# Altium project dashcam_cpu_v2.0.PrjPcb (part 9 of 13)

## Sheet usb_debug.SchDoc
size A3; SheetNumber: 11; SheetTotal: 15
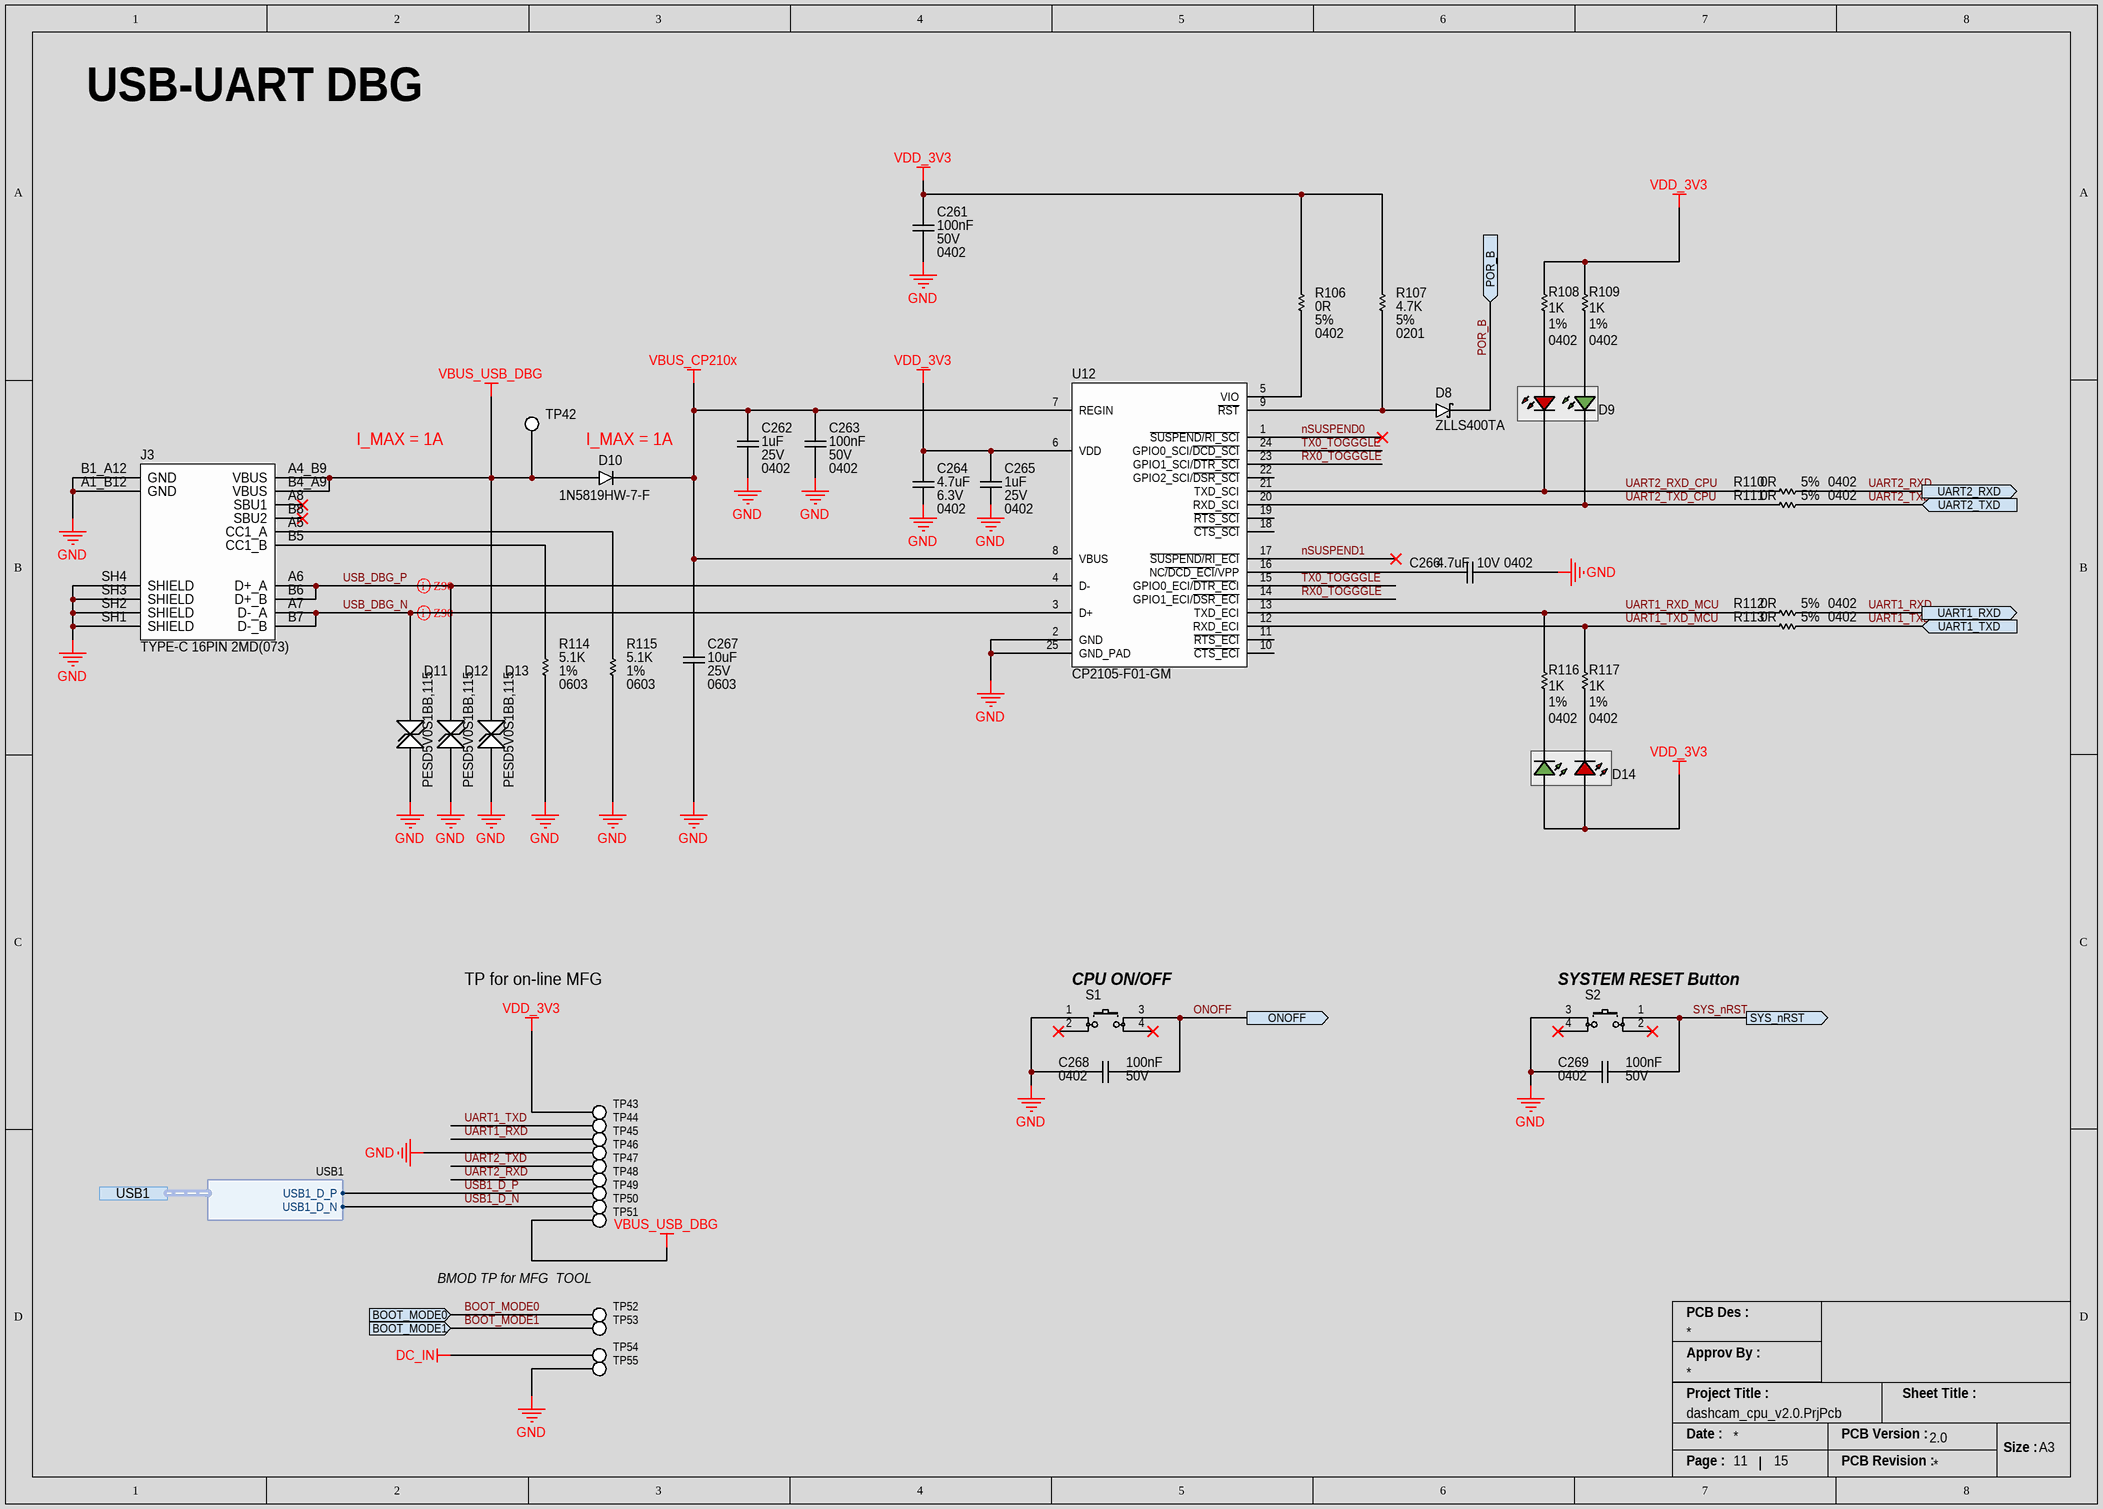
[diagram p11: usb_debug.SchDoc]

### Parts
C261  Voltage Rating: 50V  Capacitance: 100nF  Case/Package: 0402  [CAP_0402_CAPC1005X05N]  (hidden comment: GRM155R71H104KE14D)
C262  Voltage Rating: 25V  Capacitance: 1uF  Case Code (Imperial): 0402  [CAP_0402_CAPC1005X05N]  (hidden comment: GRM155R61E105KA12D)
C263  Voltage Rating: 50V  Capacitance: 100nF  Case/Package: 0402  [CAP_0402_CAPC1005X05N]  (hidden comment: GRM155R71H104KE14D)
C264  Capacitance: 4.7uF  Voltage Rating: 6.3V  Case/Package: 0402  [CAP_0402_CAPC1005X05N]  (hidden comment: C1005X5R0J475M050BC)
C265  Voltage Rating: 25V  Capacitance: 1uF  Case Code (Imperial): 0402  [CAP_0402_CAPC1005X05N]  (hidden comment: GRM155R61E105KA12D)
C266  Capacitance: 4.7uF  Voltage Rating: 10V  Case/Package: 0402  [CAP_0402_CAPC1005X05N]  (hidden comment: CL05A475KP5NRNC)
C267  Case/Package: 0603  Capacitance: 10uF  Voltage Rating: 25V  [CAP_0603_CAPC1608X08N]  (hidden comment: GRM188R61E106MA73D)
C268  Voltage Rating: 50V  Capacitance: 100nF  Case/Package: 0402  [CAP_0402_CAPC1005X05N]  (hidden comment: GRM155R71H104KE14D)
C269  Voltage Rating: 50V  Capacitance: 100nF  Case/Package: 0402  [CAP_0402_CAPC1005X05N]  (hidden comment: GRM155R71H104KE14D)
D8  ZLLS400TA  [DIO_SOD2512X113N]
D9  LTST-C195KGJRKT  [DIO_LED0606_LTST-C195]  (value not drawn)
D10  1N5819HW-7-F  [DIO_SOD3716X145N]
D11  PESD5V0S1BB,115  [DIO_TVS_SODFL1608X65N]
D12  PESD5V0S1BB,115  [DIO_TVS_SODFL1608X65N]
D13  PESD5V0S1BB,115  [DIO_TVS_SODFL1608X65N]
D14  LTST-C195KGJRKT  [DIO_LED0606_LTST-C195]  (value not drawn)
J3  TYPE-C 16PIN 2MD(073)  [CONN_USB_C_16P]
R106  Case Code (Imperial): 0402  Tolerance: 5%  Resistance: 0R  [RES_0402_RESC1005X04N]  (hidden comment: ERJ-2GE0R00X)
R107  Tolerance: 5%  Resistance: 4.7K  Case/Package: 0201  [RES_0201_RESC0603X02N]  (hidden comment: RK73B1HTTC472J)
R108  Resistance: 1K  Tolerance: 1%  Case/Package: 0402  [RES_0402_RESC1005X04N]  (hidden comment: ERJ-2RKF1001X)
R109  Resistance: 1K  Tolerance: 1%  Case/Package: 0402  [RES_0402_RESC1005X04N]  (hidden comment: ERJ-2RKF1001X)
R110  Case Code (Imperial): 0402  Tolerance: 5%  Resistance: 0R  [RES_0402_RESC1005X04N]  (hidden comment: ERJ-2GE0R00X)
R111  Case Code (Imperial): 0402  Tolerance: 5%  Resistance: 0R  [RES_0402_RESC1005X04N]  (hidden comment: ERJ-2GE0R00X)
R112  Case Code (Imperial): 0402  Tolerance: 5%  Resistance: 0R  [RES_0402_RESC1005X04N]  (hidden comment: ERJ-2GE0R00X)
R113  Case Code (Imperial): 0402  Tolerance: 5%  Resistance: 0R  [RES_0402_RESC1005X04N]  (hidden comment: ERJ-2GE0R00X)
R114  Tolerance: 1%  Resistance: 5.1K  Case/Package: 0603  [RES_0603_RESC1608X04N]  (hidden comment: RC0603FR-075K1L)
R115  Tolerance: 1%  Resistance: 5.1K  Case/Package: 0603  [RES_0603_RESC1608X04N]  (hidden comment: RC0603FR-075K1L)
R116  Resistance: 1K  Tolerance: 1%  Case/Package: 0402  [RES_0402_RESC1005X04N]  (hidden comment: ERJ-2RKF1001X)
R117  Resistance: 1K  Tolerance: 1%  Case/Package: 0402  [RES_0402_RESC1005X04N]  (hidden comment: ERJ-2RKF1001X)
S1  PTS526SK15SMTR2LFS  [SWT_NO_PTS526SK15SMTR2LFS]  (value not drawn)
S2  PTS526SK15SMTR2LFS  [SWT_NO_PTS526SK15SMTR2LFS]  (value not drawn)
TP42  NO COMPONENT  [TP_PAD_1.6MM_SMD_ROUND]  (value not drawn)  (no BOM)
TP43  NO COMPONENT  [TP_PAD_1.6MM_SMD_ROUND]  (value not drawn)  (no BOM)
TP44  NO COMPONENT  [TP_PAD_1.6MM_SMD_ROUND]  (value not drawn)  (no BOM)
TP45  NO COMPONENT  [TP_PAD_1.6MM_SMD_ROUND]  (value not drawn)  (no BOM)
TP46  NO COMPONENT  [TP_PAD_1.6MM_SMD_ROUND]  (value not drawn)  (no BOM)
TP47  NO COMPONENT  [TP_PAD_1.6MM_SMD_ROUND]  (value not drawn)  (no BOM)
TP48  NO COMPONENT  [TP_PAD_1.6MM_SMD_ROUND]  (value not drawn)  (no BOM)
TP49  NO COMPONENT  [TP_PAD_1.6MM_SMD_ROUND]  (value not drawn)  (no BOM)
TP50  NO COMPONENT  [TP_PAD_1.6MM_SMD_ROUND]  (value not drawn)  (no BOM)
TP51  NO COMPONENT  [TP_PAD_1.6MM_SMD_ROUND]  (value not drawn)  (no BOM)
TP52  NO COMPONENT  [TP_PAD_1.6MM_SMD_ROUND]  (value not drawn)  (no BOM)
TP53  NO COMPONENT  [TP_PAD_1.6MM_SMD_ROUND]  (value not drawn)  (no BOM)
TP54  NO COMPONENT  [TP_PAD_1.6MM_SMD_ROUND]  (value not drawn)  (no BOM)
TP55  NO COMPONENT  [TP_PAD_1.6MM_SMD_ROUND]  (value not drawn)  (no BOM)
U12  CP2105-F01-GM  [IC_USB_UART_QFN50P400X400X80-25N-D]

### Ports
BOOT_MODE0 (in), BOOT_MODE1 (in), ONOFF (out), POR_B (in), SYS_nRST (out), UART1_RXD (out), UART1_TXD (in), UART2_RXD (out), UART2_TXD (in), USB1 (harness USB1)

### Harnesses
USB1: USB1_D_N, USB1_D_P

### Nets
DC_IN: TP54.1
GND: C261.1 C262.1 C263.1 C264.1 C265.1 C266.2 C267.1 C268.2 C269.2 D11.1(K1) D12.1(K1) D13.1(K1) J3.A1_B12(GND) J3.B1_A12(GND) J3.SH1(SHIELD) J3.SH2(SHIELD) J3.SH3(SHIELD) J3.SH4(SHIELD) R114.1 R115.1 S1.1(COM_1) S2.3(NO1) TP46.1 TP55.1 U12.2(GND) U12.25(GND_PAD)
VBUS_CP210x: C262.2 C263.2 C267.2 D10.1(K) U12.7(REGIN) U12.8(VBUS)
VBUS_USB_DBG: D10.2(A) D13.2(K2) J3.A4_B9(VBUS) J3.B4_A9(VBUS) TP42.1 TP51.1
VDD_3V3: C261.2 C264.2 C265.2 D14.1(A1) D14.2(A2) R106.2 R107.2 R108.2 R109.2 TP43.1 U12.6(VDD)
BOOT_MODE0: TP52.1 ; port BOOT_MODE0
BOOT_MODE1: TP53.1 ; port BOOT_MODE1
nSUSPEND0: U12.1(~{SUSPEND/RI_SCI})
nSUSPEND1: U12.17(~{SUSPEND/RI_ECI})
ONOFF: C268.1 S1.3(NO1) ; port ONOFF
POR_B: D8.1(K) ; port POR_B
RX0_TOGGGLE: U12.14(GPIO1_ECI/~{DSR_ECI}) U12.23(GPIO1_SCI/~{DTR_SCI})
SYS_nRST: C269.1 S2.1(COM_1) ; port SYS_nRST
TX0_TOGGGLE: U12.15(GPIO0_ECI/~{DTR_EC}I) U12.24(GPIO0_SCI/~{DCD_SCI})
UART1_RXD: R112.2 TP45.1 ; port UART1_RXD
UART1_RXD_MCU: R112.1 R116.2 U12.13(TXD_ECI)
UART1_TXD: R113.2 TP44.1 ; port UART1_TXD
UART1_TXD_MCU: R113.1 R117.2 U12.12(RXD_ECI)
UART2_RXD: R110.2 TP48.1 ; port UART2_RXD
UART2_RXD_CPU: D9.4(K1) R110.1 U12.21(TXD_SCI)
UART2_TXD: R111.2 TP47.1 ; port UART2_TXD
UART2_TXD_CPU: D9.3(K1) R111.1 U12.20(RXD_SCI)
USB1_D_N: TP50.1 ; port USB1.USB1_D_N
USB1_D_P: TP49.1 ; port USB1.USB1_D_P
USB_DBG_N: D11.2(K2) J3.A7(D-_A) J3.B7(D-_B) U12.3(D+)
USB_DBG_P: D12.2(K2) J3.A6(D+_A) J3.B6(D+_B) U12.4(D-)
NetC266_1: C266.1 U12.16(NC~{/DCD_ECI}/VPP)
NetD8_2: D8.2(A) R107.1 U12.9(~{RST})
NetD9_1: D9.1(A1) R109.1
NetD9_2: D9.2(A2) R108.1
NetD14_3: D14.3(K1) R116.1
NetD14_4: D14.4(K1) R117.1
NetJ3_A5: J3.A5(CC1_A) R115.2
NetJ3_B5: J3.B5(CC1_B) R114.2
NetR106_1: R106.1 U12.5(VIO)

Not connected (* = marked no-connect by the designer): J3 A8(SBU1)* B8(SBU2)*; S1 2(COM2)* 4(NO2)*; S2 2(COM2)* 4(NO2)*; U12 10(~{CTS_ECI}) 11(~{RTS_ECI}) 18(~{CTS_SCI}) 19(~{RTS_SCI}) 22(GPIO2_SCI/~{DSR_SCI})

### Layout directives
differential pair; differential pair class Z90; net class Z90: USB_DBG_N, USB_DBG_P

### Notes on the sheet
- USB-UART DBG
- I_MAX = 1A
- (near D10) I_MAX = 1A
- TP for on-line MFG
- (near S1) CPU ON/OFF
- (near S2) SYSTEM RESET Button
- BMOD TP for MFG  TOOL
- PCB Des :
- Approv By :
- Project Title :
- Sheet Title :
- Date :
- PCB Version :
- Size :
- A3
- Page :
- PCB Revision :

### Library data of the parts
C261 C263 C268 C269 = CAP_100NF_50V_X7R_0402: Multilayer Ceramic Capacitor, 0.1 uF, 16 V, ± 10%, X7R, 0402 [1005 Metric]; Manufacturer: Murata; Dissipation Factor: 0.025%; Temperature Coefficient: 30ppm/°C; Supplier 1: DigiKey; Manufacturer Part Number: GRM155R71H104KE14D; RoHS: Yes; Category: Ceramic Capacitors; Stock 1: 13730790; Pricing 1: 1=0.1, 10=0.023, 50=0.0132, 100=0.0102, 500=0.00768, 1000=0.00603, 2500=0.00548, 5000=0.00504 (USD); Mount: Surface Mount; Number of Pins: 2NUMBER; Case Code (Metric): 1005; Material: Ceramic; Case Code (Imperial): 0402; Weight: 0.000212oz; Dielectric Material: Ceramic; Min Operating Temperature: -55°C; Max Operating Temperature: 125°C; Packaging: Tape and Reel; Package Quantity: 10000; Series: GRM; Tolerance: 10%; Dielectric: X7R; Termination: SMD/SMT; Voltage: 50V; Voltage Rating (DC): 50V; Construction: Flat; Length: 1mm; Width: 0.5mm; Height: 0.5mm; Depth: 0.5mm; Thickness: 0.022inch; Reach SVHC Compliant: No; RoHS Compliant: Yes; Lead Free: 5697LeadFree; ComponentLink1URL: http://www.farnell.com/datasheets/2079156.pdf?src-supplier=Farnell; ComponentLink1Description: http://www.farnell.com/datasheets/2079156.pdf?src-supplier=Farnell; ComponentLink2URL: http://www.mouser.com/ds/2/281/c02e-2905.pdf?src-supplier=Mouser; ComponentLink2Description: http://www.mouser.com/ds/2/281/c02e-2905.pdf?src-supplier=Mouser; ComponentLink3URL: http://www.farnell.com/datasheets/2079156.pdf?src-supplier=Newark; ComponentLink3Description: http://www.farnell.com/datasheets/2079156.pdf?src-supplier=Newark; ComponentLink4URL: https://datasheet.octopart.com/GRM155R71H104KE14D-Murata-datasheet-22122223.pdf?src-supplier=Future+Electronics; ComponentLink4Description: https://datasheet.octopart.com/GRM155R71H104KE14D-Murata-datasheet-22122223.pdf?src-supplier=Future+Electronics; ComponentLink5URL: https://search.murata.co.jp/Ceramy/image/img/A01X/G101/ENG/GRM155R71H104KE14-01.pdf?src-supplier=Digi-Key; ComponentLink5Description: https://search.murata.co.jp/Ceramy/image/img/A01X/G101/ENG/GRM155R71H104KE14-01.pdf?src-supplier=Digi-Key; ComponentLink6URL: http://psearch.en.murata.com/capacitor/product/GRM155R71H104KE14%23.pdf?src-supplier=Avnet; ComponentLink6Description: http://psearch.en.murata.com/capacitor/product/GRM155R71H104KE14%23.pdf?src-supplier=Avnet; ComponentLink7URL: https://datasheet.octopart.com/GRM155R71H104KE14D-Murata-datasheet-66077078.pdf?src-supplier=Element14; ComponentLink7Description: https://datasheet.octopart.com/GRM155R71H104KE14D-Murata-datasheet-66077078.pdf?src-supplier=Element14; Supplier Part Number 1: 490-10700-6-ND; Supplier 2: Digikey; Stock 2: 3706055; Pricing 2: 1=0.1, 10=0.037, 50=0.021, 100=0.0162, 500=0.01224, 1000=0.00961, 2500=0.00874, 5000=0.00804 (USD); Halogen Free: 5694HalogenFree; ComponentLink8URL: http://www.mouser.com/ds/2/447/UPY-GPHC_X5R_4V-to-50V_25-1131599.pdf?src-supplier=Mouser; ComponentLink8Description: http://www.mouser.com/ds/2/447/UPY-GPHC_X5R_4V-to-50V_25-1131599.pdf?src-supplier=Mouser; ComponentLink9URL: https://datasheet.octopart.com/CC0402KRX5R8BB104-Yageo-datasheet-137700082.pdf?src-supplier=Future+Electronics; ComponentLink9Description: https://datasheet.octopart.com/CC0402KRX5R8BB104-Yageo-datasheet-137700082.pdf?src-supplier=Future+Electronics; ComponentLink10URL: http://www.yageo.com/documents/recent/UPY-GPHC_X5R_4V-to-50V_25.pdf?src-supplier=Digikey; ComponentLink10Description: http://www.yageo.com/documents/recent/UPY-GPHC_X5R_4V-to-50V_25.pdf?src-supplier=Digikey; ComponentLink11URL: https://datasheet.octopart.com/CC0402KRX5R8BB104-Yageo-datasheet-140260304.pdf?src-supplier=Newark; ComponentLink11Description: https://datasheet.octopart.com/CC0402KRX5R8BB104-Yageo-datasheet-140260304.pdf?src-supplier=Newark; ComponentLink12URL: https://datasheet.octopart.com/CC0402KRX5R8BB104-Yageo-datasheet-170350636.pdf?src-supplier=Future+Electronics; ComponentLink12Description: https://datasheet.octopart.com/CC0402KRX5R8BB104-Yageo-datasheet-170350636.pdf?src-supplier=Future+Electronics; ComponentLink13URL: http://www.yageo.com/documents/recent/UPY-GPHC_X5R_4V-to-50V-16.pdf?src-supplier=Future+Electronics; ComponentLink13Description: http://www.yageo.com/documents/recent/UPY-GPHC_X5R_4V-to-50V-16.pdf?src-supplier=Future+Electronics; Supplier Part Number 2: 311-1697-1-ND
C262 C265 = CAP_1UF_25V_X5R_0402: Multilayer Ceramic Capacitor, 1 uF, 25 V, ± 10%, X5R, 0402 [1005 Metric]; Manufacturer: Murata; Supplier 1: Digi-Key; Manufacturer Part Number: GRM155R61E105KA12D; RoHS: Yes; Category: Ceramic Capacitors; Stock 1: 849086; Pricing 1: 1=0.1, 10=0.043, 50=0.0246, 100=0.019, 500=0.01434, 1000=0.01126, 2500=0.01024, 5000=0.00942 (USD); Mount: Surface Mount; Case/Package: 0402; Case Code (Metric): 1005; Material: Ceramic; Weight: 0.000212oz; Min Operating Temperature: -55°C; Max Operating Temperature: 85°C; Tolerance: 10%; Packaging: Cut Tape; Dielectric: X5R; Voltage: 25V; Termination: SMD/SMT; Voltage Rating (DC): 25V; Package Quantity: 10000; Series: GRM; Length: 1mm; Width: 0.5mm; Height: 0.5mm; Thickness: 0.022inch; Depth: 0.5mm; Reach SVHC Compliant: No; Lead Free: Lead Free; RoHS Compliant: Yes; ComponentLink1URL: https://datasheet.ciiva.com/7719/1666664-7719006.pdf?src-supplier=Element14; ComponentLink1Description: https://datasheet.ciiva.com/7719/1666664-7719006.pdf?src-supplier=Element14; ComponentLink2URL: https://datasheet.ciiva.com/22732/1666664-22732122.pdf?src-supplier=Element14; ComponentLink2Description: https://datasheet.ciiva.com/22732/1666664-22732122.pdf?src-supplier=Element14; Supplier Part Number 1: 490-10017-1-ND
C264 = CAP_4.7UF_6.3V_X5R_0402: Multilayer Ceramic Capacitor, 4.7 uF, 6.3 V, ± 20%, X5R, 0402 [1005 Metric]; Manufacturer: TDK; Material: 4241ConductorMaterial; Dissipation Factor: 10%; Supplier 1: Digi-Key; Manufacturer Part Number: C1005X5R0J475M050BC; RoHS: Yes; Category: Ceramic Capacitors; Stock 1: 799722; Pricing 1: 1=0.35, 10=0.233, 50=0.1716, 100=0.1396, 500=0.11024, 1000=0.0931, 2500=0.0882, 5000=0.0833 (USD); Mount: Surface Mount; Dielectric Material: Ceramic; Case Code (Metric): 1005; Case Code (Imperial): 0402; Weight: 2.3E-05oz; Min Operating Temperature: -55°C; Max Operating Temperature: 85°C; Packaging: Tape and Reel; Tolerance: 20%; Voltage Rating (DC): 6.3V; Dielectric: X5R; Package Quantity: 1; Termination: SMD/SMT; Voltage: 6.3V; Series: C; Construction: Flat; Length: 1mm; Width: 0.02inch; Height: 0.5mm; Depth: 0.5mm; Thickness: 0.026inch; Lead Free: Lead Free; Reach SVHC Compliant: No; RoHS Compliant: Yes; ComponentLink1URL: https://datasheet.ciiva.com/24216/c1005x5r0j475m050bc-264348-24216583.pdf?src-supplier=Mouser; ComponentLink1Description: https://datasheet.ciiva.com/24216/c1005x5r0j475m050bc-264348-24216583.pdf?src-supplier=Mouser; ComponentLink2URL: https://datasheet.ciiva.com/5962/639999-5962567.pdf?src-supplier=Farnell; ComponentLink2Description: https://datasheet.ciiva.com/5962/639999-5962567.pdf?src-supplier=Farnell; ComponentLink3URL: https://datasheet.ciiva.com/22648/1796654-22648701.pdf?src-supplier=Element14; ComponentLink3Description: https://datasheet.ciiva.com/22648/1796654-22648701.pdf?src-supplier=Element14; ComponentLink4URL: https://datasheet.ciiva.com/22749/1744655-22749711.pdf?src-supplier=Element14; ComponentLink4Description: https://datasheet.ciiva.com/22749/1744655-22749711.pdf?src-supplier=Element14; ComponentLink5URL: https://datasheet.ciiva.com/7770/639999-7770124.pdf?src-supplier=Element14; ComponentLink5Description: https://datasheet.ciiva.com/7770/639999-7770124.pdf?src-supplier=Element14; ComponentLink6URL: https://datasheet.ciiva.com/6289/tdkmlcccaprange-6289886.pdf?src-supplier=Digi-Key; ComponentLink6Description: https://datasheet.ciiva.com/6289/tdkmlcccaprange-6289886.pdf?src-supplier=Digi-Key; ComponentLink7URL: https://datasheet.ciiva.com/6289/tdkmlcccaprange-6289895.pdf?src-supplier=Digi-Key; ComponentLink7Description: https://datasheet.ciiva.com/6289/tdkmlcccaprange-6289895.pdf?src-supplier=Digi-Key; ComponentLink8URL: https://datasheet.ciiva.com/16425/e412-c-16425670.pdf?src-supplier=Future+Electronics; ComponentLink8Description: https://datasheet.ciiva.com/16425/e412-c-16425670.pdf?src-supplier=Future+Electronics; Supplier Part Number 1: 445-7395-1-ND
C266 = CAP_4.7UF_10V_X5R_0402: as C252 on sheet emmc_flash; Supplier 1: Digikey; Manufacturer Part Number: CL05A475KP5NRNC; RoHS: Yes; Category: Ceramic Capacitors; Stock 1: 748042; Pricing 1: 1=0.28, 10=0.184, 50=0.129, 100=0.1042, 500=0.0774, 1000=0.06772, 2500=0.0645, 5000=0.05966 (USD); Mount: Surface Mount; Case Code (Metric): 1005; Case Code (Imperial): 0402; Material: Ceramic; Min Operating Temperature: -55°C; Max Operating Temperature: 85°C; Tolerance: 10%; Packaging: Tape and Reel; Package Quantity: 1; Dielectric: X5R; Series: CL; Construction: Flat; Length: 1mm; Width: 0.02inch; Height: 0.5mm; Thickness: 0.022inch; Depth: 0.5mm; Radiation Hardening: No; RoHS Compliant: Yes; Lead Free: Lead Free; ComponentLink1URL: https://datasheet.ciiva.com/25724/cl05a475kp5nrnc-25724404.pdf?src-supplier=Digikey; ComponentLink1Description: https://datasheet.ciiva.com/25724/cl05a475kp5nrnc-25724404.pdf?src-supplier=Digikey; ComponentLink2URL: https://datasheet.ciiva.com/29198/458873-da-01-en-vs-kondensator-0402-29198304.pdf?src-supplier=Conrad; ComponentLink2Description: https://datasheet.ciiva.com/29198/458873-da-01-en-vs-kondensator-0402-29198304.pdf?src-supplier=Conrad; Supplier Part Number 1: 1276-1480-1-ND
C267 = CAP_10UF_25V_X5R_0603: Multilayer Ceramic Capacitor, 10 uF, 25 V, ± 20%, X5R, 0603 [1608 Metric]; Manufacturer: Murata; Material: 4241ConductorMaterial; Supplier 1: Digi-Key; Manufacturer Part Number: GRM188R61E106MA73D; RoHS: Yes; Category: Ceramic Capacitors; Stock 1: 2712970; Pricing 1: 1=0.26, 10=0.168, 50=0.1176, 100=0.0949, 500=0.07054, 1000=0.06173 (USD); Mount: Surface Mount; Number of Pins: 2; Case Code (Imperial): 0603; Weight: 0.000222oz; Min Operating Temperature: -55°C; Max Operating Temperature: 85°C; Tolerance: 20%; Packaging: Cut Tape; Package Quantity: 1; Dielectric: X5R; Voltage: 25V; Termination: SMD/SMT; Voltage Rating (DC): 25V; Series: GRM; Construction: Flat; Length: 1.6mm; Width: 0.031inch; Height: 0.8mm; Thickness: 0.031inch; Depth: 0.8mm; Reach SVHC Compliant: No; Lead Free: Lead Free; RoHS Compliant: Yes; ComponentLink1URL: https://datasheet.ciiva.com/22776/c02e-22776427.pdf?src-supplier=Farnell; ComponentLink1Description: https://datasheet.ciiva.com/22776/c02e-22776427.pdf?src-supplier=Farnell; ComponentLink2URL: https://datasheet.ciiva.com/22619/c02e-22619674.pdf?src-supplier=Element14; ComponentLink2Description: https://datasheet.ciiva.com/22619/c02e-22619674.pdf?src-supplier=Element14; ComponentLink3URL: https://datasheet.ciiva.com/22776/608985-22776426.pdf?src-supplier=Farnell; ComponentLink3Description: https://datasheet.ciiva.com/22776/608985-22776426.pdf?src-supplier=Farnell; ComponentLink4URL: https://datasheet.ciiva.com/14906/partnumbering-e-01-14906431.pdf?src-supplier=Digi-Key; ComponentLink4Description: https://datasheet.ciiva.com/14906/partnumbering-e-01-14906431.pdf?src-supplier=Digi-Key; ComponentLink5URL: https://datasheet.ciiva.com/14906/partnumbering-e-01-14906429.pdf?src-supplier=Digi-Key; ComponentLink5Description: https://datasheet.ciiva.com/14906/partnumbering-e-01-14906429.pdf?src-supplier=Digi-Key; Supplier Part Number 1: 490-7202-1-ND; Case Code (Metric): 1608
D8 = DIO_SCTKY_40V_520mA_ZLLS400TA: DIODE SCHOTTKY 40V 520MA SOD323; Manufacturer: Diodes Zetex; Peak Non-Repetitive Surge Current: 12A; Max Reverse Current: 10uA; Forward Voltage: 800mV; Reverse Recovery Time: 3ns; Max Forward Surge Current (Ifsm): 2.5A; Power Dissipation: 330mW; Polarity: Standard; Capacitance: 15pF; Supplier 1: Digi-Key; Manufacturer Part Number: ZLLS400TA; RoHS: Yes; Category: Rectifier Diodes; Stock 1: 46017; Pricing 1: 1=0.42, 10=0.359, 100=0.2495, 500=0.19478, 1000=0.15832 (USD); Mount: Surface Mount; Number of Pins: 2; Weight: 0.000173oz; Min Operating Temperature: -55°C; Max Operating Temperature: 150°C; Forward Current: 520mA; Max Repetitive Reverse Voltage (Vrrm): 40V; Package Quantity: 3000; Packaging: Tape and Reel; Average Rectified Current: 520mA; Termination: SMD/SMT; Voltage Rating (DC): 40V; Current Rating: 520mA; Output Current: 520mA; Max Reverse Voltage (DC): 40V; Series: -; Length: 1.8mm; Width: 1.4mm; Height: 0.8mm; Radiation Hardening: No; Lead Free: Lead Free; RoHS Compliant: Yes; ComponentLink1URL: https://datasheet.ciiva.com/914/zlls400-914210.pdf?src-supplier=Digi-Key; ComponentLink1Description: https://datasheet.ciiva.com/914/zlls400-914210.pdf?src-supplier=Digi-Key; ComponentLink2URL: https://datasheet.ciiva.com/914/zlls400-914210.pdf?src-supplier=Avnet; ComponentLink2Description: https://datasheet.ciiva.com/914/zlls400-914210.pdf?src-supplier=Avnet; ComponentLink3URL: https://datasheet.ciiva.com/4715/zlls400-4715517.pdf?src-supplier=Mouser; ComponentLink3Description: https://datasheet.ciiva.com/4715/zlls400-4715517.pdf?src-supplier=Mouser; ComponentLink4URL: https://datasheet.ciiva.com/16379/zlls400-16379288.pdf?src-supplier=Future+Electronics; ComponentLink4Description: https://datasheet.ciiva.com/16379/zlls400-16379288.pdf?src-supplier=Future+Electronics; ComponentLink5URL: https://datasheet.ciiva.com/914/zlls400-914211.pdf?src-supplier=Digi-Key; ComponentLink5Description: https://datasheet.ciiva.com/914/zlls400-914211.pdf?src-supplier=Digi-Key; ComponentLink6URL: https://datasheet.ciiva.com/914/zlls400-914212.pdf?src-supplier=Digi-Key; ComponentLink6Description: https://datasheet.ciiva.com/914/zlls400-914212.pdf?src-supplier=Digi-Key; Supplier Part Number 1: ZLLS400TACT-ND
D9 D14 = LED_DIO_BICOLOR_LTST-C195KGJRKT: LED GREEN/RED CLEAR 0606 SMD; Manufacturer: Vishay Lite-On; Color: Green,Red; Lens Color: Colorless; Lens Style: Flat,Diffused,Colorless,Rectangular,Clear; Viewing Angle: 130°; Luminous Intensity: 45mcd; Forward Current: 30mA; Forward Voltage: 2.4V; Dominant Wavelength: 631nm; Test Current: 20mA; Power Rating: 75mW; Wavelength: 639nm; Number of LEDs: 2; Reverse Voltage: 5V; Lens Size: 1.5mm; Supplier 1: Digikey; Manufacturer Part Number: LTST-C195KGJRKT; RoHS: Yes; Category: LEDs; Stock 1: 405899; Pricing 1: 1=0.43, 10=0.283, 100=0.1886, 500=0.13042, 1000=0.10868, 2000=0.09781 (USD); Mount: Surface Mount; Case/Package: 0606; Number of Pins: 2; Case Code (Metric): 1616; Case Code (Imperial): 0606; Min Operating Temperature: -55°C; Max Operating Temperature: 85°C; Packaging: Tape and Reel; Package Quantity: 4000; Illumination Color: Green,Red; Lens Transparency: Clear; Series: -; Number of Elements: 2; Power Dissipation: 75mW; Length: 1.6mm; Width: 1.5mm; Height: 0.55mm; Depth: 1.5mm; Radiation Hardening: No; RoHS Compliant: Yes; Lead Free: Lead Free; ComponentLink1URL: https://datasheet.ciiva.com/11774/0900766b80dc055f-11774310.pdf?src-supplier=Rs; ComponentLink1Description: https://datasheet.ciiva.com/11774/0900766b80dc055f-11774310.pdf?src-supplier=Rs; ComponentLink2URL: https://datasheet.ciiva.com/16287/ltst-c195kgjrkt-16287821.pdf?src-supplier=Future+Electronics; ComponentLink2Description: https://datasheet.ciiva.com/16287/ltst-c195kgjrkt-16287821.pdf?src-supplier=Future+Electronics; ComponentLink3URL: https://datasheet.ciiva.com/2110/ltst-c195kgjrkt-2110796.pdf?src-supplier=Digikey; ComponentLink3Description: https://datasheet.ciiva.com/2110/ltst-c195kgjrkt-2110796.pdf?src-supplier=Digikey; ComponentLink4URL: https://datasheet.ciiva.com/15117/getdatasheetpartid-123527-15117625.pdf?src-supplier=Verical; ComponentLink4Description: https://datasheet.ciiva.com/15117/getdatasheetpartid-123527-15117625.pdf?src-supplier=Verical; ComponentLink5URL: https://datasheet.ciiva.com/2110/p-100-ltst-c195kgjrkt-2110797.pdf?src-supplier=Digikey; ComponentLink5Description: https://datasheet.ciiva.com/2110/p-100-ltst-c195kgjrkt-2110797.pdf?src-supplier=Digikey; ComponentLink6URL: https://datasheet.ciiva.com/2110/p-100-ltst-c195kgjrkt-2110798.pdf?src-supplier=Digikey; ComponentLink6Description: https://datasheet.ciiva.com/2110/p-100-ltst-c195kgjrkt-2110798.pdf?src-supplier=Digikey; Supplier Part Number 1: 160-1452-1-ND
D10 = DIO_RECT_40V_1A_1N5819HW-7-F: Rectifier Diode, Schottky, 1 Phase, 1 Element, 1A, 40V V(RRM), Silicon; Manufacturer: Diodes; Max Reverse Current: 50uA; Max Forward Surge Current (Ifsm): 25A; Forward Voltage: 450mV; Max Power Dissipation: 450mW; Polarity: Standard; Capacitance: 50pF; Supplier 1: Digikey; Manufacturer Part Number: 1N5819HW-7-F; RoHS: Yes; Category: Rectifier Diodes; Stock 1: 221439; Pricing 1: 1=0.41, 10=0.289, 100=0.146, 500=0.11908, 1000=0.08836 (USD); Case/Package: SOD-123-2; Number of Pins: 2; Weight: 0.000353oz; Min Operating Temperature: -65°C; Max Operating Temperature: 125°C; Forward Current: 1A; Max Repetitive Reverse Voltage (Vrrm): 40V; Packaging: Tape and Reel; Peak Non-Repetitive Surge Current: 25A; Package Quantity: 3000; Average Rectified Current: 1A; Termination: SMD/SMT; Voltage Rating (DC): 40V; Current Rating: 1A; Output Current: 1A; Max Reverse Voltage (DC): 40V; Series: -; Reverse Voltage: 40V; Length: 2.85mm; Width: 1.7mm; Height: 1.25mm; Radiation Hardening: No; RoHS Compliant: Yes; Reach SVHC Compliant: No; Lead Free: Lead Free; ComponentLink1URL: https://datasheet.ciiva.com/16303/ds30217-16303296.pdf?src-supplier=Future+Electronics; ComponentLink1Description: https://datasheet.ciiva.com/16303/ds30217-16303296.pdf?src-supplier=Future+Electronics; ComponentLink2URL: https://datasheet.ciiva.com/27092/1538419-27092484.pdf?src-supplier=Jameco; ComponentLink2Description: https://datasheet.ciiva.com/27092/1538419-27092484.pdf?src-supplier=Jameco; ComponentLink3URL: https://datasheet.ciiva.com/912/ds30217-912801.pdf?src-supplier=Digikey; ComponentLink3Description: https://datasheet.ciiva.com/912/ds30217-912801.pdf?src-supplier=Digikey; ComponentLink4URL: https://datasheet.ciiva.com/912/ds30217-912802.pdf?src-supplier=Digikey; ComponentLink4Description: https://datasheet.ciiva.com/912/ds30217-912802.pdf?src-supplier=Digikey; ComponentLink5URL: https://datasheet.ciiva.com/912/ds30217-912803.pdf?src-supplier=Digikey; ComponentLink5Description: https://datasheet.ciiva.com/912/ds30217-912803.pdf?src-supplier=Digikey; ComponentLink6URL: https://datasheet.ciiva.com/8303/ds30217-8303132.pdf?src-supplier=Avnet; ComponentLink6Description: https://datasheet.ciiva.com/8303/ds30217-8303132.pdf?src-supplier=Avnet; ComponentLink7URL: https://datasheet.ciiva.com/1177/ds30217-1177089.pdf?src-supplier=Element14; ComponentLink7Description: https://datasheet.ciiva.com/1177/ds30217-1177089.pdf?src-supplier=Element14; Supplier Part Number 1: 1N5819HW-FDIDKR-ND
D11-D13 = DIO_TVS_BID_5V_PESD5V0S1BB,115: ESD Suppressor Diode TVS Bi-Dir 5V Automotive 2-Pin SOD-523 T/R / TVS DIODE 5VWM 14VC SOD523; Manufacturer: Nexperia; Breakdown Voltage: 5.5V; Supplier 1: Digikey; Manufacturer Part Number: PESD5V0S1BB,115; RoHS: Yes; Category: ESD and Circuit Protection ICs; Stock 1: 221713; Pricing 1: 1=0.35, 10=0.243, 100=0.1226, 500=0.10004, 1000=0.07422, 3000=0.06245, 6000=0.0597, 9000=0.05163, 30000=0.05067, 75000=0.04195, 150000=0.04131 (USD); Number of Pins: 2; Packaging: Tape and Reel; Operating Supply Voltage: 5V; RoHS Compliant: Yes; ComponentLink1URL: http://www.farnell.com/datasheets/461331.pdf?src-supplier=Farnell; ComponentLink1Description: http://www.farnell.com/datasheets/461331.pdf?src-supplier=Farnell; ComponentLink2URL: https://www.mouser.com/ds/2/302/PESD5V0S1BA_BB_BL-1150699.pdf?src-supplier=Mouser; ComponentLink2Description: https://www.mouser.com/ds/2/302/PESD5V0S1BA_BB_BL-1150699.pdf?src-supplier=Mouser; ComponentLink3URL: https://assets.nexperia.com/documents/data-sheet/PESD5V0S1BA_BB_BL.pdf?src-supplier=Digikey; ComponentLink3Description: https://assets.nexperia.com/documents/data-sheet/PESD5V0S1BA_BB_BL.pdf?src-supplier=Digikey; ComponentLink4URL: http://www.farnell.com/datasheets/461331.pdf?src-supplier=Newark; ComponentLink4Description: http://www.farnell.com/datasheets/461331.pdf?src-supplier=Newark; Supplier Part Number 1: 1727-3838-1-ND
J3 = CONN_USB_TYPEC_2.0_16P_TYPE-C 16PIN 2MD(073): 5A 1 Surface Mount 16P Female -25℃~+85℃ Type-C SMD USB Connectors ROHS; Manufacturer: SHOU HAN; Supplier 1: LCSC; Manufacturer Part Number: TYPE-C 16PIN 2MD(073); RoHS: No; Category: Connectors; Pricing 1: 0.0523 (USD); Supplier Part Number 1: 664-12402012E212ACT-ND
R106 R110-R113 = RES_0R_5%_100mW_0402: SMD Chip Resistor, Jumper, 0 ohm, 100 mW, 0402 [1005 Metric], Thick Film, General Purpose; Manufacturer: Panasonic; Power Rating: 100mW; Voltage Rating: 50V; Temperature Coefficient: 600ppm/°C; Supplier 1: Mouser; Manufacturer Part Number: ERJ-2GE0R00X; RoHS: Yes; Category: Chip SMD Resistors; Stock 1: 10989354; Pricing 1: 1=0.1, 10=0.013, 50=0.013, 100=0.006, 1000=0.004, 2500=0.003, 10000=0.003 (USD); Mount: Surface Mount; Case/Package: 0402; Contact Plating: Tin; Case Code (Metric): 1005; Size Code: 0402; Min Operating Temperature: -55°C; Max Operating Temperature: 155°C; Resistor Type: Thick Film; Packaging: Cut Tape; Package Quantity: 10000; Number of Terminations: 2; Termination: SMD/SMT; Max Power Dissipation: 100mW; Voltage Rating (DC): 50V; Features: Automotive AEC-Q200; Series: ERJ; Construction: Rectangular; Technology: THICK FILM; Length: 1mm; Width: 0.5mm; Height: 0.35mm; Depth: 0.5mm; Ratings: AEC-Q200; Radiation Hardening: No; Reach SVHC Compliant: No; Military Standard: Not; Lead Free: Lead Free; RoHS Compliant: Yes; ComponentLink1URL: https://datasheet.ciiva.com/11821/0900766b80f806dd-11821176.pdf?src-supplier=Rs; ComponentLink1Description: https://datasheet.ciiva.com/11821/0900766b80f806dd-11821176.pdf?src-supplier=Rs; ComponentLink2URL: https://datasheet.ciiva.com/43460/1678796-43460347.pdf?src-supplier=Farnell; ComponentLink2Description: https://datasheet.ciiva.com/43460/1678796-43460347.pdf?src-supplier=Farnell; ComponentLink3URL: https://datasheet.ciiva.com/46389/1678796-46389518.pdf?src-supplier=Element14; ComponentLink3Description: https://datasheet.ciiva.com/46389/1678796-46389518.pdf?src-supplier=Element14; ComponentLink4URL: https://datasheet.ciiva.com/5959/1678796-5959692.pdf?src-supplier=Farnell; ComponentLink4Description: https://datasheet.ciiva.com/5959/1678796-5959692.pdf?src-supplier=Farnell; ComponentLink5URL: https://datasheet.ciiva.com/28695/1678796-28695758.pdf?src-supplier=Element14; ComponentLink5Description: https://datasheet.ciiva.com/28695/1678796-28695758.pdf?src-supplier=Element14; ComponentLink6URL: https://datasheet.ciiva.com/16783/70260739-16783734.pdf?src-supplier=Allied+Electronics; ComponentLink6Description: https://datasheet.ciiva.com/16783/70260739-16783734.pdf?src-supplier=Allied+Electronics; ComponentLink7URL: https://datasheet.ciiva.com/16778/70260739-16778335.pdf?src-supplier=Allied+Electronics; ComponentLink7Description: https://datasheet.ciiva.com/16778/70260739-16778335.pdf?src-supplier=Allied+Electronics; ComponentLink8URL: https://datasheet.ciiva.com/48531/aoa0000ce1-48531077.pdf?src-supplier=Avnet; ComponentLink8Description: https://datasheet.ciiva.com/48531/aoa0000ce1-48531077.pdf?src-supplier=Avnet; ComponentLink9URL: https://datasheet.ciiva.com/30097/4aoa0000ce1-30097116.pdf?src-supplier=Onlinecomponents.com; ComponentLink9Description: https://datasheet.ciiva.com/30097/4aoa0000ce1-30097116.pdf?src-supplier=Onlinecomponents.com; Supplier Part Number 1: 667-ERJ-2GE0R00X
R107 = RES_4.7K_5%_50mW_0201: Res Thick Film 0201 4.7K Ohm 5% 0.05W(1/20W) ±200ppm/C Pad SMD Automotive T/R; Manufacturer: KOA Speer; Power Rating: 50mW; Voltage Rating: 25V; Temperature Coefficient: 200ppm/°C; Supplier 1: Digikey; Manufacturer Part Number: RK73B1HTTC472J; RoHS: Yes; Category: Chip SMD Resistors; Stock 1: 410528; Pricing 1: 1=0.1, 10=0.033, 50=0.021, 100=0.0177, 500=0.01224, 1000=0.0106, 5000=0.00782 (USD); Case Code (Imperial): 0201; Case Code (Metric): 0603; Min Operating Temperature: -55°C; Max Operating Temperature: 125°C; Packaging: Tape and Reel; Termination: SMD/SMT; Voltage Rating (DC): 25V; Series: RK73B; Construction: Rectangular; Length: 0.6mm; Depth: 0.3mm; Military Standard: Not; Lead Free: Lead Free; RoHS Compliant: Yes; ComponentLink1URL: https://datasheet.ciiva.com/5556/rk73b-5556381.pdf?src-supplier=Mouser; ComponentLink1Description: https://datasheet.ciiva.com/5556/rk73b-5556381.pdf?src-supplier=Mouser; Supplier Part Number 1: 2019-RK73B1HTTC472JDKR-ND
R108 R109 R116 R117 = RES_1K_1%_100mW_0402: RES SMD 1K OHM 1% 1/10W 0402; Manufacturer: Panasonic; Temperature Coefficient: 100ppm/°C; Max Power Dissipation: 100mW; Voltage Rating (DC): 50V; Supplier 1: Digi-Key; Manufacturer Part Number: ERJ-2RKF1001X; RoHS: Yes; Category: Chip SMD Resistors; Stock 1: 2367361; Pricing 1: 1=0.1, 10=0.029, 50=0.0162, 100=0.0119, 500=0.00728, 1000=0.00535, 5000=0.00384 (USD); Mount: Surface Mount; Number of Pins: 2; Case Code (Imperial): 0402; Case Code (Metric): 1005; Contact Plating: Tin; Min Operating Temperature: -55°C; Max Operating Temperature: 155°C; Packaging: Tape and Reel; Number of Terminations: 2; Features: Automotive AEC-Q200; Voltage Rating: 50V; Power Rating: 100mW; Package Quantity: 1; Termination: SMD/SMT; Resistor Type: Thick Film; Series: ERJ; Resistance Tolerance: 1%; Construction: Rectangular; Technology: THICK FILM; Length: 1mm; Width: 0.5mm; Height: 0.35mm; Depth: 0.5mm; Lead Free: Lead Free; RoHS Compliant: Yes; Reach SVHC Compliant: Yes; Military Standard: Not; Supplier Part Number 1: P1.00KLCT-ND
R114 R115 = RES_5.1K_1%_100mW_0603: SMD Chip Resistor, 5.1 kOhm, ± 1%, 100 mW, 0603 [1608 Metric], Thick Film, General Purpose; Manufacturer: Yageo; Power Rating: 100mW; Temperature Coefficient: 100ppm/°C; Voltage Rating (DC): 50V; Supplier 1: Digi-Key; Manufacturer Part Number: RC0603FR-075K1L; RoHS: Yes; Category: Chip SMD Resistors; Stock 1: 3197702; Pricing 1: 1=0.1, 10=0.018, 50=0.0106, 100=0.0088, 500=0.00592, 1000=0.00505 (USD); Number of Pins: 2; Case Code (Imperial): 0603; Case Code (Metric): 1608; Size Code: 0603; Min Operating Temperature: -55°C; Max Operating Temperature: 155°C; Series: RC; Packaging: Tape and Reel; Package Quantity: 1; Termination: SMD/SMT; Resistor Type: Thick Film; Number of Terminations: 2; Max Power Dissipation: 100mW; Features: Moisture Resistant; Resistance Tolerance: 1%; Construction: Rectangular; Length: 0.063inch; Width: 0.031inch; Height: 0.022inch; Depth: 0.8mm; RoHS Compliant: Yes; Reach SVHC Compliant: No; Military Standard: Not; Lead Free: Lead Free; ComponentLink1URL: https://datasheet.ciiva.com/15189/getdatasheetpartid-326732-15189786.pdf?src-supplier=Verical; ComponentLink1Description: https://datasheet.ciiva.com/15189/getdatasheetpartid-326732-15189786.pdf?src-supplier=Verical; ComponentLink2URL: https://datasheet.ciiva.com/46395/443971-46395016.pdf?src-supplier=Element14; ComponentLink2Description: https://datasheet.ciiva.com/46395/443971-46395016.pdf?src-supplier=Element14; ComponentLink3URL: https://datasheet.ciiva.com/2454/pyu-r-int-thick-7-2454045.pdf?src-supplier=Digi-Key; ComponentLink3Description: https://datasheet.ciiva.com/2454/pyu-r-int-thick-7-2454045.pdf?src-supplier=Digi-Key; ComponentLink4URL: https://datasheet.ciiva.com/2454/pyu-r-int-thick-7-2454046.pdf?src-supplier=Digi-Key; ComponentLink4Description: https://datasheet.ciiva.com/2454/pyu-r-int-thick-7-2454046.pdf?src-supplier=Digi-Key; ComponentLink5URL: https://datasheet.ciiva.com/2454/pyu-r-int-thick-7-2454047.pdf?src-supplier=Digi-Key; ComponentLink5Description: https://datasheet.ciiva.com/2454/pyu-r-int-thick-7-2454047.pdf?src-supplier=Digi-Key; Supplier Part Number 1: 311-5.10KHRCT-ND; Voltage Rating: 50V
S1 S2 = SWITCH_NO_SPST_0.05A: Switch Tactile N.O. SPST Round Button Gull Wing 0.05A 12VDC 200000Cycles 2.55N SMD T/R; Manufacturer: ITT C&K; Supplier 1: Digi-Key; Manufacturer Part Number: PTS526SK15SMTR2LFS; RoHS: No; Category: Uncategorized; Stock 1: 382158; Pricing 1: 1=0.12, 10=0.12, 25=0.114, 100=0.1035, 250=0.09732, 500=0.08904, 1000=0.07454 (USD); Supplier Part Number 1: CKN12221-6-ND
TP42-TP55 = TP_PAD_SMD_Round: Test Point, SMD pad, round, 1.5mm, 1.6mm, 3mm diameter
U12 = IC_USB_UART_CP2105-F01-GM: IC SGL USB-DL UART BRIDGE 24QFN; Manufacturer: Silicon Labs; Number of Channels: 1; Max Supply Voltage: 3.6V; Min Supply Voltage: 3V; Data Rate: 12Mbps; Operating Supply Current: 17mA; Operating Supply Voltage: 3.3V; Supplier 1: Digi-Key; Manufacturer Part Number: CP2105-F01-GM; RoHS: Yes; Category: USB Interface ICs; Stock 1: 3004; Pricing 1: 1=5.17, 10=4.639, 25=4.386, 100=3.8011, 250=3.6062, 500=3.23584, 1000=2.72902, 2500=2.59257 (USD); Case/Package: QFN; Number of Pins: 24; Weight: 0.001368oz; Contact Plating: Tin,Matte; Min Operating Temperature: -40°C; Max Operating Temperature: 85°C; Packaging: Rail/Tube; Package Quantity: 91; Number of Transceivers: 1; Series: -; Length: 4mm; Width: 4mm; Height: 0.75mm; Radiation Hardening: No; RoHS Compliant: Yes; ComponentLink1URL: https://datasheet.ciiva.com/25624/0900766b811077c5-25624105.pdf?src-supplier=Rs; ComponentLink1Description: https://datasheet.ciiva.com/25624/0900766b811077c5-25624105.pdf?src-supplier=Rs; ComponentLink2URL: https://datasheet.ciiva.com/1784/cp2105-1784466.pdf?src-supplier=Digi-Key; ComponentLink2Description: https://datasheet.ciiva.com/1784/cp2105-1784466.pdf?src-supplier=Digi-Key; ComponentLink3URL: https://datasheet.ciiva.com/3148/cp2105-3148817.pdf?src-supplier=Avnet; ComponentLink3Description: https://datasheet.ciiva.com/3148/cp2105-3148817.pdf?src-supplier=Avnet; ComponentLink4URL: https://datasheet.ciiva.com/26815/getdatasheetpartid-358512-26815926.pdf?src-supplier=Verical; ComponentLink4Description: https://datasheet.ciiva.com/26815/getdatasheetpartid-358512-26815926.pdf?src-supplier=Verical; Supplier Part Number 1: 336-2009-5-ND

## Sheet connector_b.SchDoc
size A3; SheetNumber: 15; SheetTotal: 15
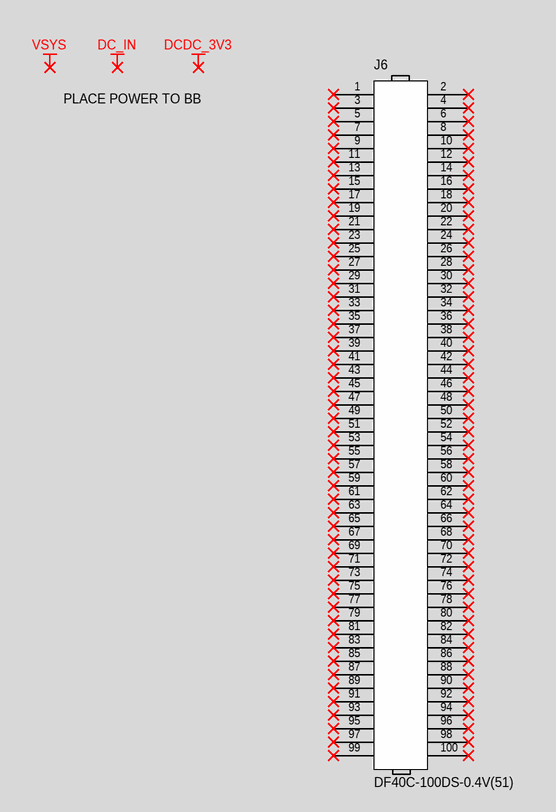
[diagram p12: connector_b.SchDoc]

### Parts
J6  DF40C-100DS-0.4V(51)  [CONN_B2B_HIROSE_DF40C-100DS-0.4V(51)]

### Nets

Not connected (* = marked no-connect by the designer): J6 1* 2* 3* 4* 5* 6* 7* 8* 9* 10* 11* 12* 13* 14* 15* 16* 17* 18* 19* 20* 21* 22* 23* 24* 25* 26* 27* 28* 29* 30* 31* 32* 33* 34* 35* 36* 37* 38* 39* 40* 41* 42* 43* 44* 45* 46* 47* 48* 49* 50* 51* 52* 53* 54* 55* 56* 57* 58* 59* 60* 61* 62* 63* 64* 65* 66* 67* 68* 69* 70* 71* 72* 73* 74* 75* 76* 77* 78* 79* 80* 81* 82* 83* 84* 85* 86* 87* 88* 89* 90* 91* 92* 93* 94* 95* 96* 97* 98* 99* 100*

### Notes on the sheet
- PLACE POWER TO BB
- Labels drawn without touching a wire or pin: DC_IN, DCDC_3V3, VSYS
- PCB Des :
- Approv By :
- Project Title :
- Sheet Title :
- Date :
- PCB Version :
- Size :
- A3
- Page :
- PCB Revision :

### Library data of the parts
J6 = CONN_B2B_100P_RE_DF40C-100DS-0.4V(51): Board-to-Board Connector with 0.4-mm Pitch, 1.5 - 4.0-mm Height - DF40 Series (HIROSE ELECTRIC); Voltage Rating: 30V; Current Rating: 300mA; Connector Type: Receptacle; Number of Positions: 100; Contact Resistance: 90mR; Pitch: 0.4mm; Mated Stacking Heights: 1.5mm; Contact Pitch: 400um; Supplier 1: Digikey; Manufacturer: Hirose; Manufacturer Part Number: DF40C-100DS-0.4V(51); RoHS: Yes; Category: Headers and Wire Housings; Stock 1: 4275; Pricing 1: 1=1.91, 10=1.661, 25=1.5908, 50=1.5554, 100=1.4847, 250=1.34328, 500=1.23724, 1000=1.0605, 2500=0.9898 (USD); Mount: Surface Mount; Contact Material: Bronze; Contact Plating: Gold; Housing Material: Polymer; Housing Color: Black; Min Operating Temperature: -35°C; Max Operating Temperature: 85°C; Number of Rows: 2; Packaging: Tape and Reel; Package Quantity: 1; Termination: SMD/SMT; Number of Contacts: 100; Orientation: Straight; Series: DF40; Max Current Rating: 300mA; Max Voltage Rating (AC): 30V; Gender: Receptacle; Contact Voltage Rating (AC): 30V; Contact Voltage Rating (DC): 30V; Length: 22.6mm; Depth: 3.38mm; Radiation Hardening: No; Reach SVHC Compliant: No; Lead Free: Lead Free; RoHS Compliant: Yes; ComponentLink1URL: https://datasheet.ciiva.com/26948/getdatasheetpartid-441624-26948933.pdf?src-supplier=Verical; ComponentLink1Description: https://datasheet.ciiva.com/26948/getdatasheetpartid-441624-26948933.pdf?src-supplier=Verical; ComponentLink2URL: https://datasheet.ciiva.com/46408/1824826-46408894.pdf?src-supplier=Element14; ComponentLink2Description: https://datasheet.ciiva.com/46408/1824826-46408894.pdf?src-supplier=Element14; Supplier Part Number 1: H11615CT-ND

## Sheet connector_a.SchDoc
size A3; SheetNumber: 14; SheetTotal: 15
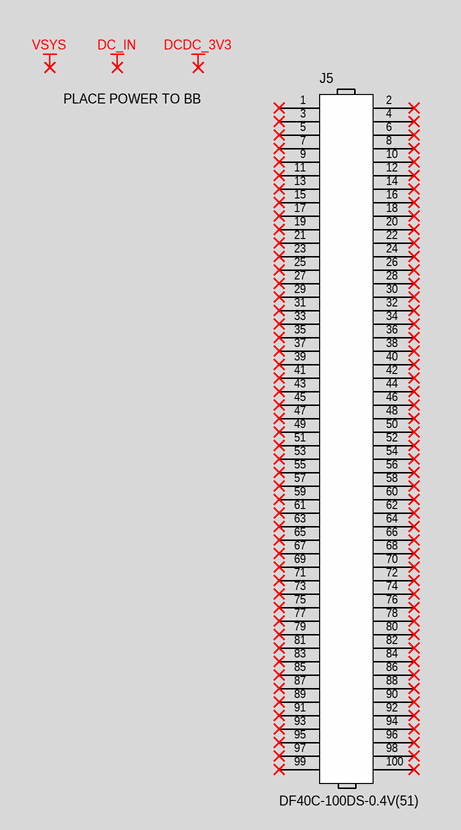
[diagram p13: connector_a.SchDoc]

### Parts
J5  DF40C-100DS-0.4V(51)  [CONN_B2B_HIROSE_DF40C-100DS-0.4V(51)]

### Nets

Not connected (* = marked no-connect by the designer): J5 1* 2* 3* 4* 5* 6* 7* 8* 9* 10* 11* 12* 13* 14* 15* 16* 17* 18* 19* 20* 21* 22* 23* 24* 25* 26* 27* 28* 29* 30* 31* 32* 33* 34* 35* 36* 37* 38* 39* 40* 41* 42* 43* 44* 45* 46* 47* 48* 49* 50* 51* 52* 53* 54* 55* 56* 57* 58* 59* 60* 61* 62* 63* 64* 65* 66* 67* 68* 69* 70* 71* 72* 73* 74* 75* 76* 77* 78* 79* 80* 81* 82* 83* 84* 85* 86* 87* 88* 89* 90* 91* 92* 93* 94* 95* 96* 97* 98* 99* 100*

### Notes on the sheet
- PLACE POWER TO BB
- Labels drawn without touching a wire or pin: DC_IN, DCDC_3V3, VSYS
- PCB Des :
- Approv By :
- Project Title :
- Sheet Title :
- Date :
- PCB Version :
- Size :
- A3
- Page :
- PCB Revision :

### Library data of the parts
J5 = CONN_B2B_100P_RE_DF40C-100DS-0.4V(51): as J6 on sheet connector_b; Supplier 1: Digikey; Manufacturer: Hirose; Manufacturer Part Number: DF40C-100DS-0.4V(51); RoHS: Yes; Category: Headers and Wire Housings; Stock 1: 4275; Pricing 1: 1=1.91, 10=1.661, 25=1.5908, 50=1.5554, 100=1.4847, 250=1.34328, 500=1.23724, 1000=1.0605, 2500=0.9898 (USD); Mount: Surface Mount; Contact Material: Bronze; Contact Plating: Gold; Housing Material: Polymer; Housing Color: Black; Min Operating Temperature: -35°C; Max Operating Temperature: 85°C; Number of Rows: 2; Packaging: Tape and Reel; Package Quantity: 1; Termination: SMD/SMT; Number of Contacts: 100; Orientation: Straight; Series: DF40; Max Current Rating: 300mA; Max Voltage Rating (AC): 30V; Gender: Receptacle; Contact Voltage Rating (AC): 30V; Contact Voltage Rating (DC): 30V; Length: 22.6mm; Depth: 3.38mm; Radiation Hardening: No; Reach SVHC Compliant: No; Lead Free: Lead Free; RoHS Compliant: Yes; ComponentLink1URL: https://datasheet.ciiva.com/26948/getdatasheetpartid-441624-26948933.pdf?src-supplier=Verical; ComponentLink1Description: https://datasheet.ciiva.com/26948/getdatasheetpartid-441624-26948933.pdf?src-supplier=Verical; ComponentLink2URL: https://datasheet.ciiva.com/46408/1824826-46408894.pdf?src-supplier=Element14; ComponentLink2Description: https://datasheet.ciiva.com/46408/1824826-46408894.pdf?src-supplier=Element14; Supplier Part Number 1: H11615CT-ND